# Altium schematic sheet COVER_PAGE.SchDoc
size A4; SheetNumber: 2; SheetTotal: 10
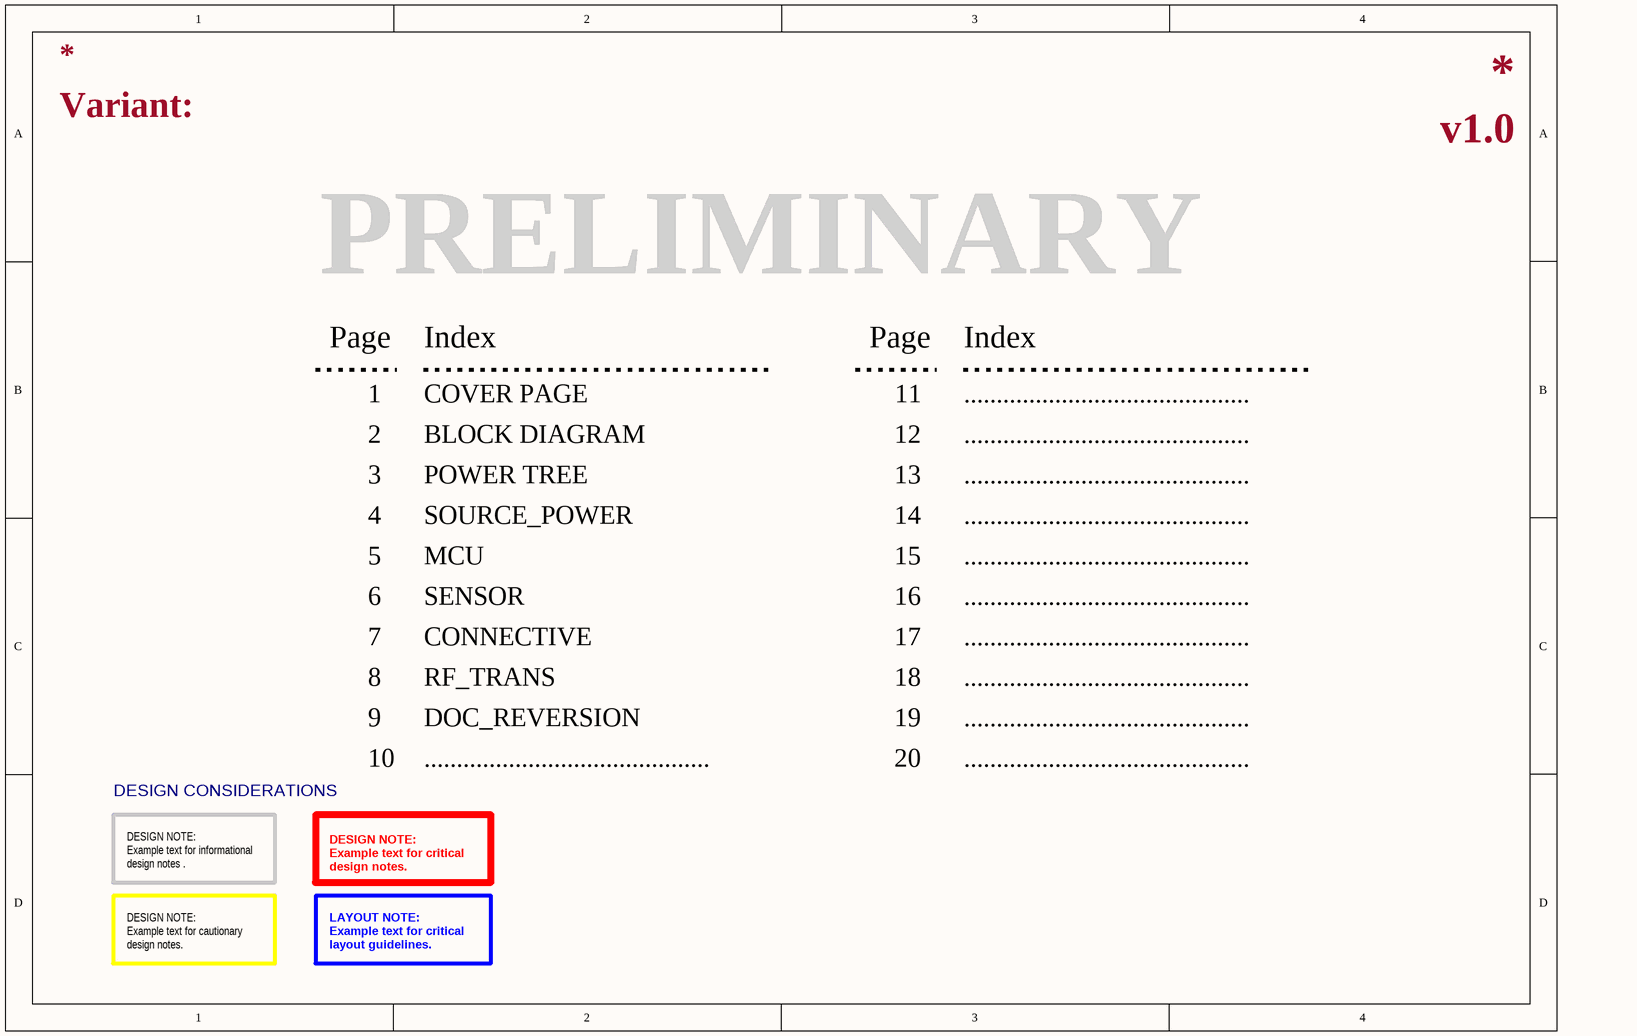
[diagram p0: COVER_PAGE.SchDoc]

## Notes on the sheet
- Variant:
- v1.0
- PRELIMINARY
- Page
- Index
- 1
- 2
- COVER PAGE
- BLOCK DIAGRAM
- 11
- 12
- ............................................
- 3
- POWER TREE
- 13
- 4
- 5
- SOURCE_POWER
- MCU
- 14
- 15
- 6
- 7
- SENSOR
- CONNECTIVE
- 16
- 17
- 8
- RF_TRANS
- 18
- 9
- 10
- DOC_REVERSION
- 19
- 20
- DESIGN CONSIDERATIONS
- DESIGN NOTE:
  Example text for informational
  design notes .
- DESIGN NOTE:
  Example text for critical
  design notes.
- DESIGN NOTE:
  Example text for cautionary
  design notes.
- LAYOUT NOTE:
  Example text for critical
  layout guidelines.